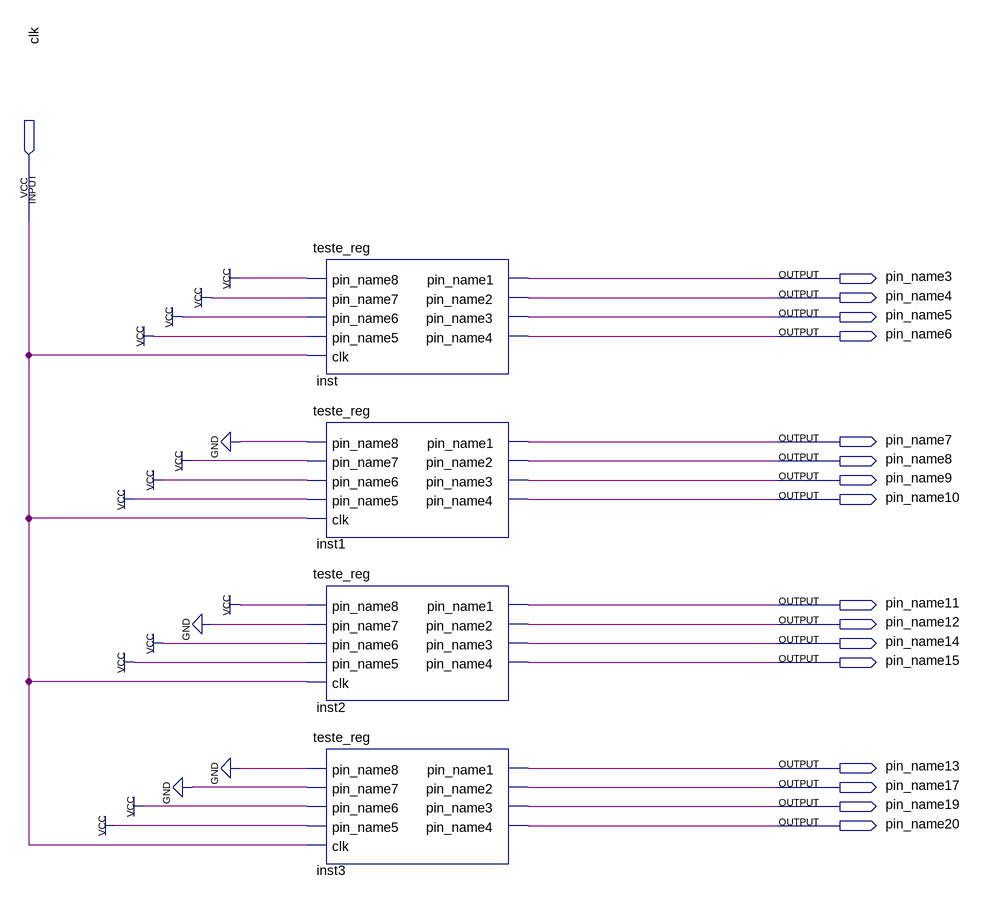
[diagram p0: schematic sheet]
// Quartus schematic registrador(1).bdf as structural Verilog: 4 symbols, 17 pins
module \registrador(1)  (
  input  clk,
  output pin_name3,
  output pin_name4,
  output pin_name5,
  output pin_name6,
  output pin_name7,
  output pin_name8,
  output pin_name9,
  output pin_name10,
  output pin_name11,
  output pin_name12,
  output pin_name14,
  output pin_name15,
  output pin_name13,
  output pin_name17,
  output pin_name19,
  output pin_name20
);

  teste_reg inst (
    .pin_name8(1'b1), .pin_name7(1'b1), .pin_name6(1'b1), .pin_name5(1'b1), .clk(clk), .pin_name1(pin_name3),
    .pin_name2(pin_name4), .pin_name3(pin_name5), .pin_name4(pin_name6));
  teste_reg inst1 (
    .pin_name8(1'b0), .pin_name7(1'b1), .pin_name6(1'b1), .pin_name5(1'b1), .clk(clk), .pin_name1(pin_name7),
    .pin_name2(pin_name8), .pin_name3(pin_name9), .pin_name4(pin_name10));
  teste_reg inst2 (
    .pin_name8(1'b1), .pin_name7(1'b0), .pin_name6(1'b1), .pin_name5(1'b1), .clk(clk),
    .pin_name1(pin_name11), .pin_name2(pin_name12), .pin_name3(pin_name14), .pin_name4(pin_name15));
  teste_reg inst3 (
    .pin_name8(1'b0), .pin_name7(1'b0), .pin_name6(1'b1), .pin_name5(1'b1), .clk(clk),
    .pin_name1(pin_name13), .pin_name2(pin_name17), .pin_name3(pin_name19), .pin_name4(pin_name20));
endmodule
